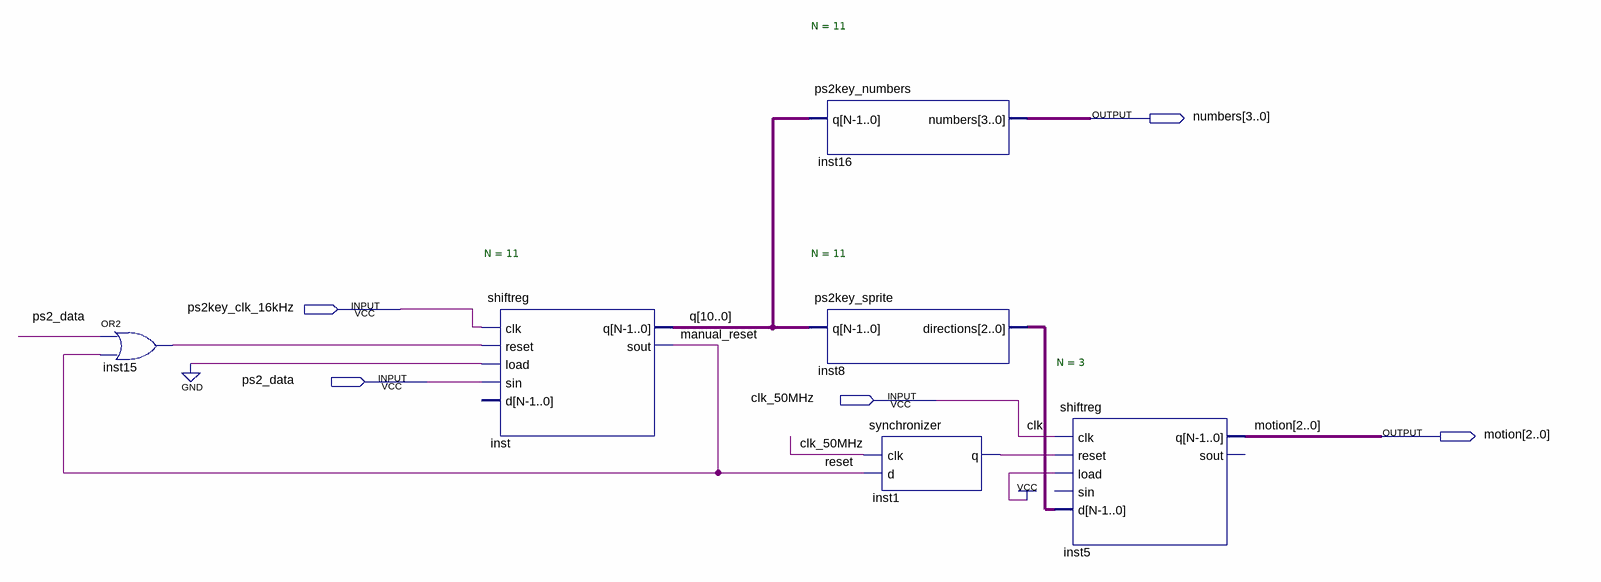
[diagram p0: schematic sheet]
// Quartus schematic ps2driver.bdf as structural Verilog: 6 symbols, 5 pins
module ps2driver (
  input  ps2key_clk_16kHz,
  input  ps2_data,
  input  clk_50MHz,
  output [3:0] numbers,
  output [2:0] motion
);

  wire inst1_q, manual_reset, reset;
  wire [2:0] inst8_directions;
  wire [10:0] q;

  or inst15 (manual_reset, ps2_data, reset);
  shiftreg #(.N(11)) inst (
    .clk(ps2key_clk_16kHz), .reset(manual_reset), .load(1'b0), .sin(ps2_data), .q(q), .sout(reset));  // open: d
  ps2key_numbers #(.N(11)) inst16 (.q(q), .numbers(numbers));
  ps2key_sprite #(.N(11)) inst8 (.q(q), .directions(inst8_directions));
  synchronizer inst1 (.clk(clk_50MHz), .d(reset), .q(inst1_q));
  shiftreg #(.N(3)) inst5 (
    .clk(clk_50MHz), .reset(inst1_q), .load(1'b1), .d(inst8_directions), .q(motion));  // open: sin, sout

  // Other names for the same wires on the sheet: clk = clk_50MHz
endmodule
